# EAGLE design xbee_to_avr_routed (EAGLE 5.06)
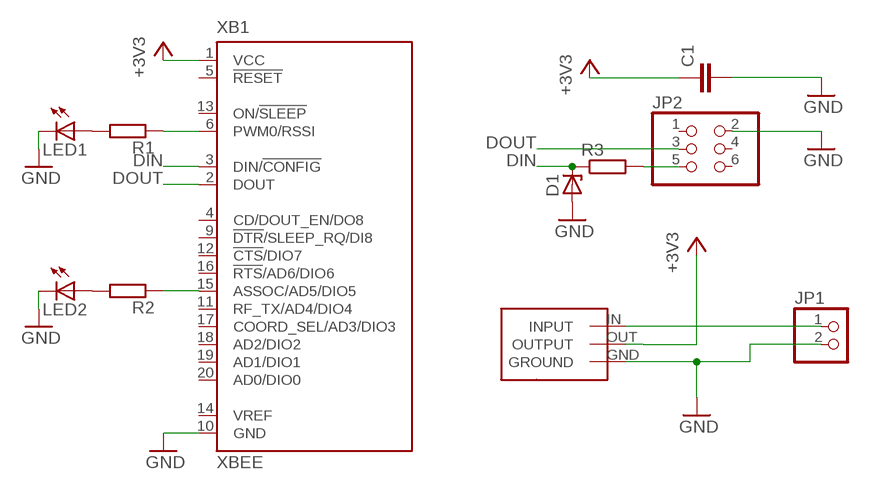
[diagram p0: schematic, sheet 1]

## Parts
C1  C-EU050-024X044  [C050-024X044]
D1  ZENER-DIODEDO35Z10  [DO35Z10]
JP1  PINHD-1X2  [1X02]
JP2  PINHD-2X3  [2X03]
LED1  LED3MM  [LED3MM]
LED2  LED3MM  [LED3MM]
R1  R-EU_0207/10  [0207/10]
R2  R-EU_0207/10  [0207/10]
R3  R-EU_0207/10  [0207/10]
U$1  LM1086  [LM1086]
XB1  XBEE  [XBEE]

## Nets
+3V3: C1.1 U$1.OUT(OUTPUT) XB1.1(VCC)
DIN: D1.C R3.1 XB1.3(DIN/!CONFIG)
DOUT: JP2.3 XB1.2(DOUT)
GND: C1.2 D1.A JP1.2 JP2.2 LED1.K(C) LED2.K(C) U$1.GND(GROUND) XB1.10(GND)
N$1: JP2.5 R3.2
N$2: JP1.1 U$1.IN(INPUT)
N$7: LED1.A R1.2
N$8: LED2.A R2.2
N$9: R1.1 XB1.6(PWM0/RSSI)
N$10: R2.1 XB1.15(ASSOC/AD5/DIO5)
Unconnected: JP2.1 JP2.4 JP2.6 XB1.4(CD/DOUT_EN/DO8) XB1.5(!RESET) XB1.9(!DTR!/SLEEP_RQ/DI8) XB1.11(RF_TX/AD4/DIO4) XB1.12(!CTS!/DIO7) XB1.13(ON/!SLEEP) XB1.14(VREF) XB1.16(!RTS!/AD6/DIO6) XB1.17(COORD_SEL/AD3/DIO3) XB1.18(AD2/DIO2) XB1.19(AD1/DIO1) XB1.20(AD0/DIO0)

## Library data of the parts
C1 = rcl:C-EU: CAPACITOR, European symbol
D1 = diode:ZENER-DIODE: Z-Diode
JP1 = pinhead:PINHD-1X2: PIN HEADER
JP2 = pinhead:PINHD-2X3: PIN HEADER
LED1 LED2 = led:LED: LED OSRAM: - CHIPLED LG R971, LG N971, LY N971, LG Q971, LY Q971, LO R971, LY R971 LH N974, LH R974 LS Q976, LO Q976, LY Q976 LO Q996 - Hyper CHIPLED LW Q18S LB Q993, LB Q99A, LB R99A - SideLED LS A670, LO A670, LY A670, LG A670, LP A670 LB A673, LV A673, LT A673, LW A673 LH A674 LY A675 LS A676, LA A676, LO A676, LY A676, LW A676 LS A679, LY A679, LG A679 - Hyper Micro SIDELED® LS Y876, LA Y876, LO Y876, LY Y876 LT Y87S - SmartLED LW L88C, LW L88S LB L89C, LB L89S, LG L890 LS L89K, LO L89K, LY L89K LS L896, LA L896, LO L896, LY L896 - TOPLED LS T670, LO T670, LY T670, LG T670, LP T670 LSG T670, LSP T670, LSY T670, LOP T670, LYG T670 LG T671, LOG T671, LSG T671 LB T673, LV T673, LT T673, LW T673 LH T674 LS T676, LA T676, LO T676, LY T676, LB T676, LH T676, LSB T676, LW T676 LB T67C, LV T67C, LT T67C, LS T67K, LO T67K, LY T67K, LW E67C LS E67B, LA E67B, LO E67B, LY E67B, LB E67C, LV E67C, LT E67C LW T67C LS T679, LY T679, LG T679 LS T770, LO T770, LY T770, LG T770, LP T770 LB T773, LV T773, LT T773, LW T773 LH T774 LS E675, LA E675, LY E675, LS T675 LS T776, LA T776, LO T776, LY T776, LB T776 LHGB T686 LT T68C, LB T68C - Hyper Mini TOPLED® LB M676 - Mini TOPLED Santana® LG M470 LS M47K, LO M47K, LY M47K Source: http://www.osram.convergy.de LUXEON: - LUMILED® LXK2-PW12-R00, LXK2-PW12-S00, LXK2-PW14-U00, LXK2-PW14-V00 LXK2-PM12-R00, LXK2-PM12-S00, LXK2-PM14-U00 LXK2-PE12-Q00, LXK2-PE12-R00, LXK2-PE12-S00, LXK2-PE14-T00, LXK2-PE14-U00 LXK2-PB12-K00, LXK2-PB12-L00, LXK2-PB12-M00, LXK2-PB14-N00, LXK2-PB14-P00, LXK2-PB14-Q00 LXK2-PR12-L00, LXK2-PR12-M00, LXK2-PR14-Q00, LXK2-PR14-R00 LXK2-PD12-Q00, LXK2-PD12-R00, LXK2-PD12-S00 LXK2-PH12-R00, LXK2-PH12-S00 LXK2-PL12-P00, LXK2-PL12-Q00, LXK2-PL12-R00 Source: www.luxeon.com KINGBRIGHT: KA-3528ASYC Source: www.kingbright.com
R1-R3 = rcl:R-EU_: RESISTOR, European symbol
U$1 = unicorn:LM1086
XB1 = maxstream:XBEE: XBee (TM) /XBee-PRO(TM) OEM RF Modules Source: MaxStream, Inc. xbee_productmanual.pdf

## Board
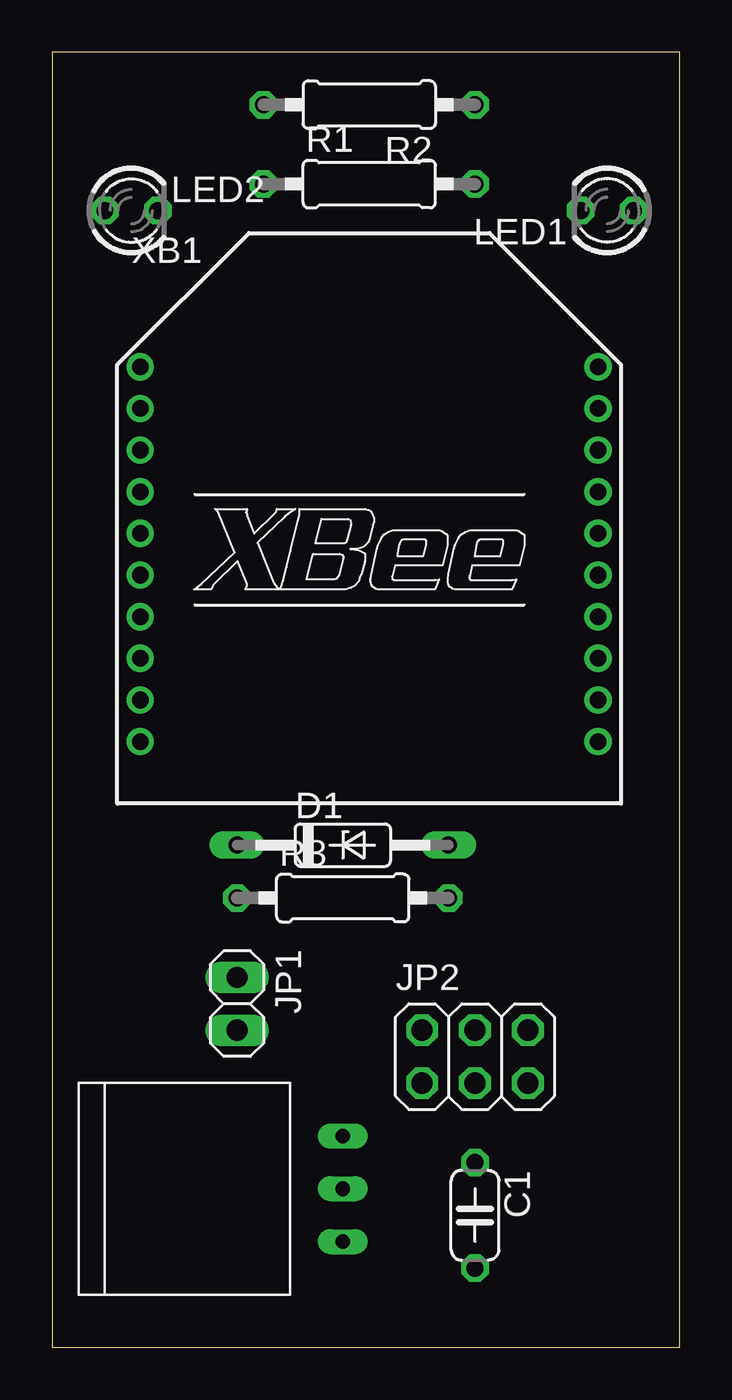
[diagram p1: board, top side]
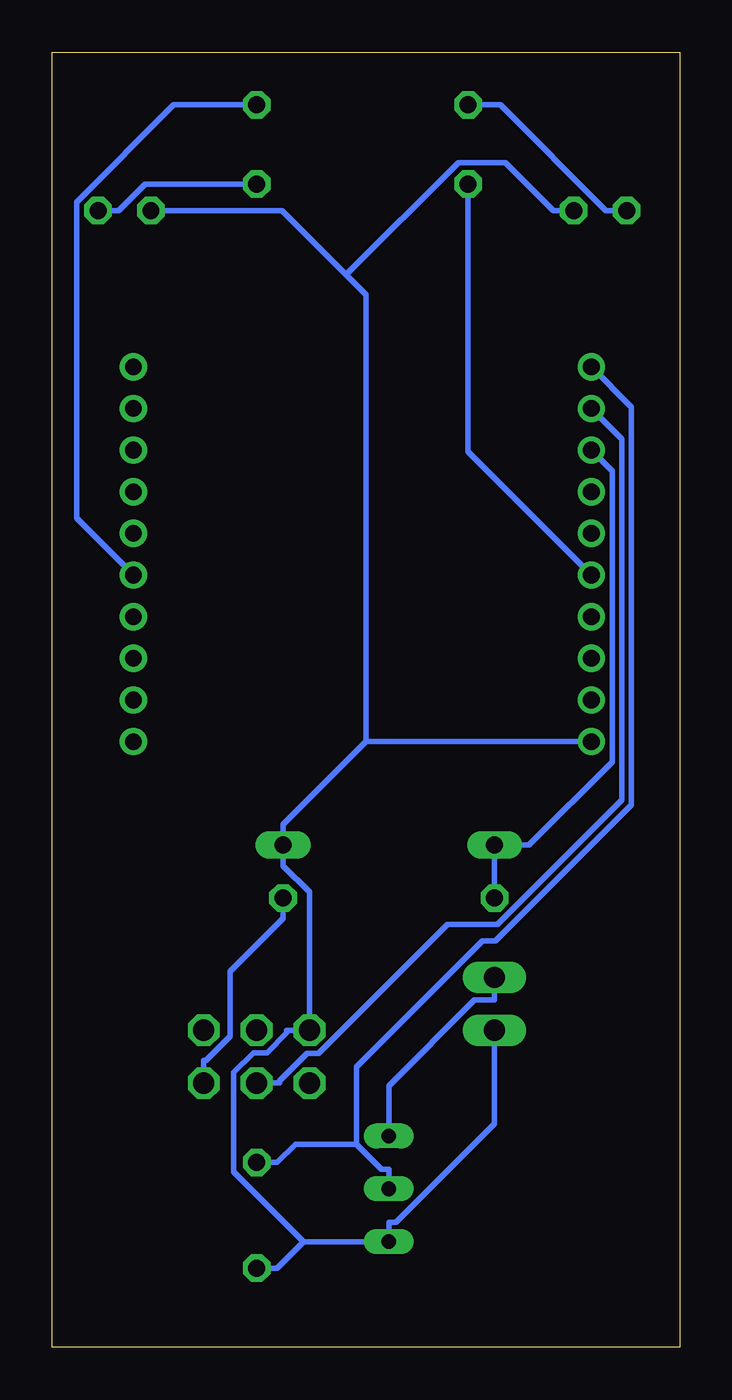
[diagram p2: board, bottom side, seen from below]

Size 30.15 x 62.22 mm. Coordinates in mm from the lower left corner, seen from the top.
Outline: 0,0 30.15,0 30.15,62.22 0,62.22 0,0
Copper layers (1*16): Top 0.035mm / dielectric 1.5mm / Bottom 0.035mm
Design rules "default": minimum track width 10mil, minimum drill 24mil, track to track 8mil, track to pad 8mil, pad to pad 8mil, via to via 8mil, smd to smd 8mil, copper to edge 40mil, drill to drill 8mil, minimum pad ring 10mil, minimum via ring 8mil, stop-mask expansion 4mil, vias tented up to drill 0mil, thermal gap 10mil
tRestrict: area 0,0 to 30.5,62.2

### Footprints (pad centres in the part's own frame; a part is rotated, then mirrored left to right if it is on the bottom)
C050-024X044 = drill 0.813 octagon: 1 -2.54,0; 2 2.54,0
DO35Z10 = drill 0.813 long: A 5.08,0; C -5.08,0
1X02 = drill 1.016 long: 1 -1.27,0; 2 1.27,0
2X03 = drill 1.016 octagon: 1 -2.54,-1.27; 2 -2.54,1.27; 3 0,-1.27; 4 0,1.27; 5 2.54,-1.27; 6 2.54,1.27
LED3MM = drill 0.813 octagon: A -1.27,0; K 1.27,0
0207/10 = drill 0.813 octagon: 1 -5.08,0; 2 5.08,0
LM1086 = drill 0.7 long: GND 0,-2.54; IN 0,2.54; OUT 0,0
XBEE = drill 0.8 pad 1.27 round: 1 -11,9; 2 -11,7; 3 -11,5; 4 -11,3; 5 -11,1; 6 -11,-1; 7 -11,-3; 8 -11,-5; 9 -11,-7; 10 -11,-9; 11 11,-9; 12 11,-7; 13 11,-5; 14 11,-3; 15 11,-1; 16 11,1; 17 11,3; 18 11,5; 19 11,7; 20 11,9

### Placement (x,y rotation side)
C1  20.32,6.35 270 top
D1  13.97,24.13 0 top
JP1  8.89,16.51 270 top
JP2  20.32,13.97 0 top
LED1  26.67,54.61 180 top
LED2  3.81,54.61 0 top
R1  15.24,55.88 0 top
R2  15.24,59.69 180 top
R3  13.97,21.59 0 top
U$1  13.97,7.62 0 top
XB1  15.24,38.1 0 top

### Tracks (layer width: path | path; a pad name or v marks a point on that pad's centre or on a via)
+3V3
  Bottom 0.254: 15.53,9.76 14.32,8.55 13.97,8.55 U$1.OUT | XB1.1 2.31,45.17 2.31,26.07 8.85,19.52 9.48,19.52 15.53,13.48 15.53,9.76 | 15.53,9.76 18.46,9.76 19.33,8.89 C1.1
DIN
  Bottom 0.254: XB1.3 3.24,42.1 3.24,28.13 7.24,24.13 D1.C R3.1
DOUT
  Bottom 0.254: XB1.2 2.76,43.62 2.76,26.3 8.76,20.31 11.16,20.31 17.34,14.13 17.91,14.13 19.23,12.81 19.23,12.7 JP2.3
GND
  Bottom 0.254: 15.07,29.1 19.05,25.12 D1.A 19.05,23.14 17.78,21.87 JP2.2 18.87,15.24 18.87,15.1 19.83,14.15 20.48,14.15 21.42,13.21 21.42,8.44 18.06,5.08 | 15.07,29.1 XB1.10 | 15.07,29.1 15.07,50.57 16.02,51.52 | 16.02,51.52 19.11,54.61 LED1.K | 16.02,51.52 10.62,56.92 8.38,56.92 6.07,54.61 LED2.K | 18.06,5.08 19.33,3.81 C1.2 | 18.06,5.08 U$1.GND 13.97,6.01 13.62,6.01 8.89,10.74 JP1.2
N$1
  Bottom 0.254: JP2.5 22.86,13.79 22.75,13.79 21.59,14.95 21.59,18.06 19.05,20.6 R3.2
N$2
  Bottom 0.254: JP1.1 8.89,16.69 9.85,16.69 13.97,12.56 U$1.IN
N$7
  Bottom 0.254: LED1.A 26.95,54.61 25.68,55.88 R1.2
N$8
  Bottom 0.254: LED2.A 3.53,54.61 8.61,59.69 R2.2
N$9
  Bottom 0.254: XB1.6 10.16,43.02 R1.1
N$10
  Bottom 0.254: XB1.15 28.97,39.83 28.97,55.01 24.3,59.69 R2.1